# EAGLE design smd_9 (EAGLE 9.3.0)
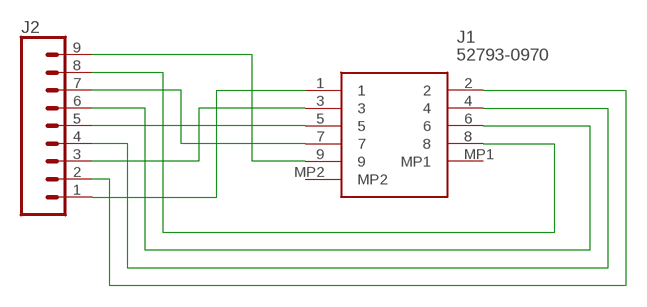
[diagram p0: schematic, sheet 1]

## Parts
J1  52793-0970  [527930970]
J2  CONN_09  [1X09]

## Nets
N$1: J1.1 J2.1
N$2: J1.2 J2.2
N$3: J1.3 J2.3
N$4: J1.4 J2.4
N$5: J1.5 J2.5
N$6: J1.6 J2.6
N$7: J1.7 J2.7
N$8: J1.8 J2.8
N$9: J1.9 J2.9
Unconnected: J1.MP1 J1.MP2

## Library data of the parts
J1 = 52793-0970:52793-0970: FFC & FPC Connectors 1.0 FFC Non ZIF HsgA ssySMT 9CktEmbsTpPkg Source: Datasheet <http://www.mouser.com/datasheet/2/276/0527930970_FFC_FPC_CONNECTORS-170567.pdf>; ALLIED_NUMBER: 71463739; ALLIED_PRICE-STOCK: https://www.alliedelec.com/molexincorporated-52793-0970/71463739/; DESCRIPTION: FFC & FPC Connectors 1.0 FFC Non ZIF HsgA ssySMT 9CktEmbsTpPkg; HEIGHT: 3.3mm; MANUFACTURER_NAME: Molex; MANUFACTURER_PART_NUMBER: 52793-0970; MOUSER_PART_NUMBER: 538-52793-0970; MOUSER_PRICE-STOCK: https://www.mouser.com/Search/Refine.aspx?Keyword=538-52793-0970
J2 = SparkFun-Connectors:CONN_09: Multi connection point. Often used as Generic Header-pin footprint for 0.1 inch spaced/style header connections On any of the 0.1 inch spaced packages, you can populate with these: Break Away Headers - Straight <https://www.sparkfun.com/products/116> (PRT-00116) Break Away Male Headers - Right Angle <https://www.sparkfun.com/products/553> (PRT-00553) Female Headers <https://www.sparkfun.com/products/115> (PRT-00115) Break Away Headers - Machine Pin <https://www.sparkfun.com/products/117> (PRT-00117) Break Away Female Headers - Swiss Machine Pin <https://www.sparkfun.com/products/743> (PRT-00743) For SCREWTERMINALS and SPRING TERMINALS visit here: Screw Terimnals on SparkFun.com <https://www.sparkfun.com/search/results?term=Screw+Terminals> (5mm/3.5mm/2.54mm spacing) This device is also useful as a general connection point to wire up your design to another part of your project. Our various solder wires solder well into these plated through hole pads. Hook-Up Wire - Assortment (Stranded, 22 AWG) <https://www.sparkfun.com/products/11375> (PRT-11375) Hook-Up Wire - Assortment (Solid Core, 22 AWG) <https://www.sparkfun.com/products/11367> (PRT-11367) View the entire wire category on our website here <https://www.sparkfun.com/categories/141> Special notes: Molex polarized connector foot print use with SKU : PRT-08231 with associated crimp pins and housings. 1MM SMD Version SKU: PRT-10208 NOTES ON THE VARIANTS LOCK and LOCK_LONGPADS... This footprint was designed to help hold the alignment of a through-hole component (i.e. 6-pin header) while soldering it into place. You may notice that each hole has been shifted either up or down by 0.005 of an inch from it's more standard position (which is a perfectly straight line). This slight alteration caused the pins (the squares in the middle) to touch the edges of the holes. Because they are alternating, it causes a "brace" to hold the component in place. 0.005 has proven to be the perfect amount of "off-center" position when using our standard breakaway headers. Although looks a little odd when you look at the bare footprint, once you have a header in there, the alteration is very hard to notice. Also,if you push a header all the way into place, it is covered up entirely on the bottom side.

## Net classes
0 default: clearance 0.254 mm

## Board
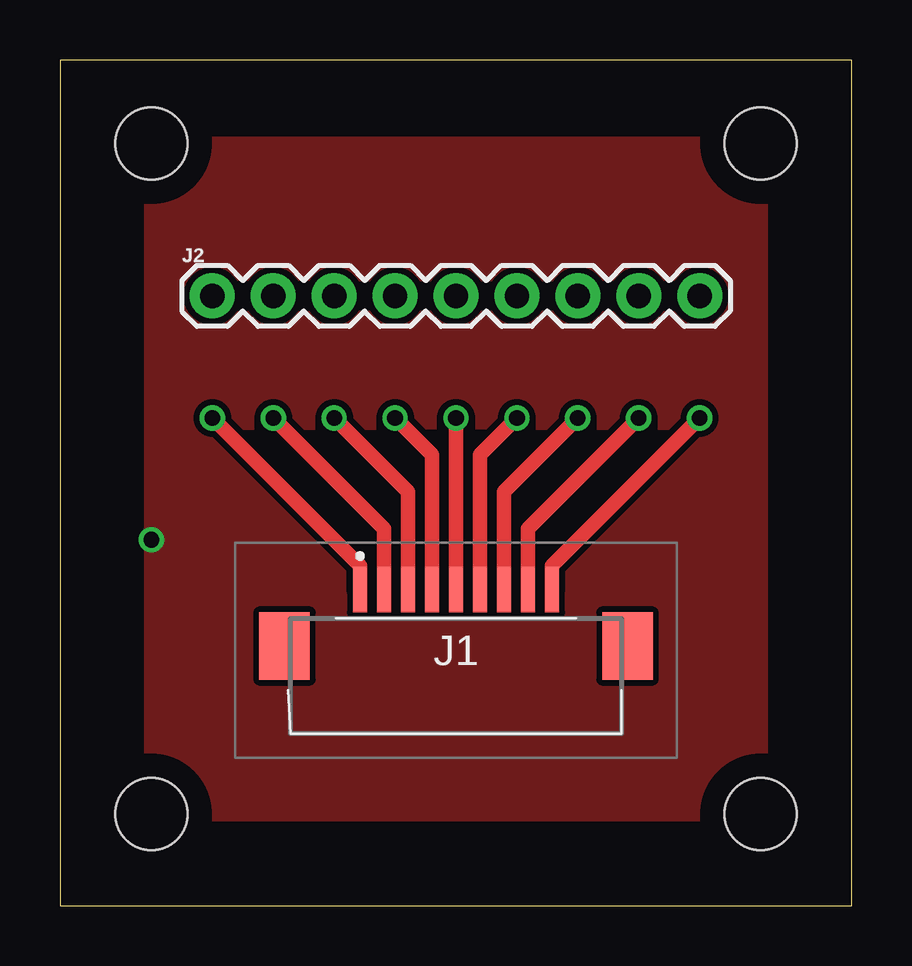
[diagram p1: board, top side]
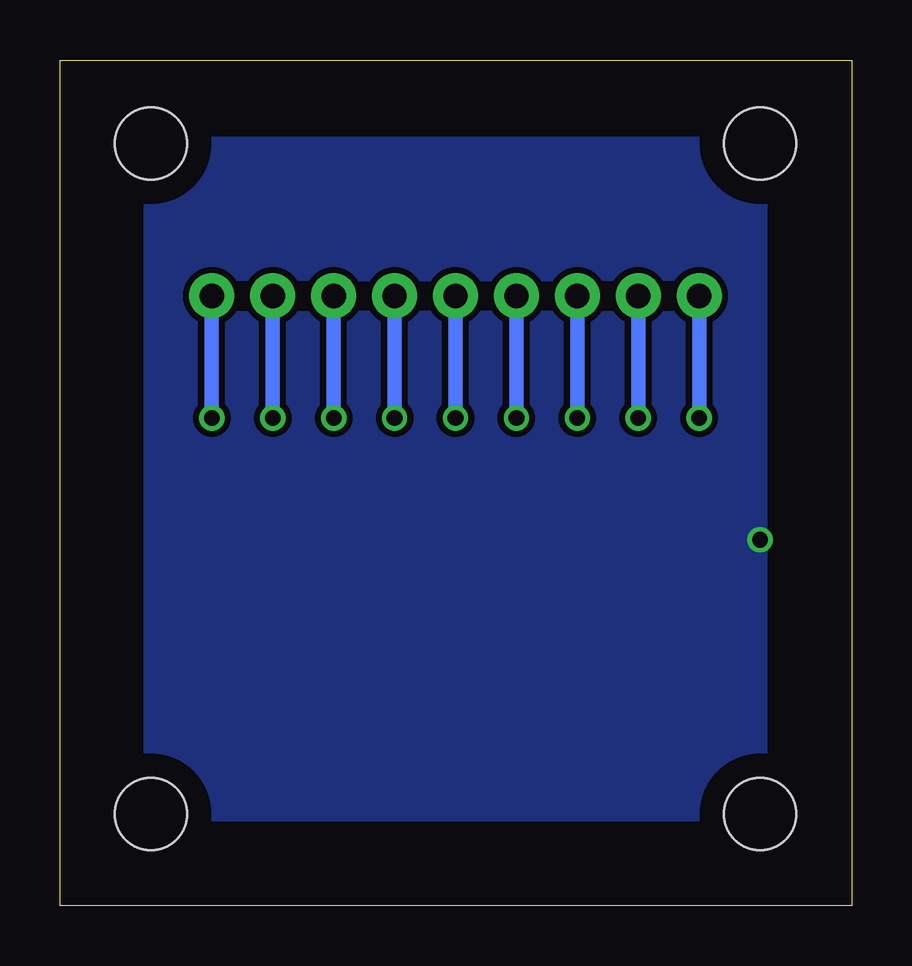
[diagram p2: board, bottom side, seen from below]

Size 33 x 35.23 mm. Coordinates in mm from the lower left corner, seen from the top.
Outline: 0,0 33,0 33,35.23 0,35.23 0,0
Copper layers (1*16): Top 0.035mm / dielectric 1.5mm / Bottom 0.035mm
Design rules "default": minimum track width 6mil, minimum drill 0.35mm, track to track 6mil, track to pad 6mil, pad to pad 6mil, via to via 6mil, smd to smd 6mil, copper to edge 40mil, drill to drill 6mil, minimum pad ring 10mil, minimum via ring 8mil, stop-mask expansion 4mil, vias tented up to drill 0mil, thermal gap 10mil
Holes 3 mm at 3.81,3.81 29.21,3.81 29.21,31.75 3.81,31.75

### Footprints (pad centres in the part's own frame; a part is rotated, then mirrored left to right if it is on the bottom)
527930970 = smd 0.6 x 1.9: 1 -4,3; 2 -3,3; 3 -2,3; 4 -1,3; 5 0,3; 6 1,3; 7 2,3; 8 3,3; 9 4,3 | smd 2.1 x 2.8: MP1 -7.15,0.65; MP2 7.15,0.65
1X09 = drill 1.016 pad 1.88: 1 0,0; 2 2.54,0; 3 5.08,0; 4 7.62,0; 5 10.16,0; 6 12.7,0; 7 15.24,0; 8 17.78,0; 9 20.32,0

### Placement (x,y rotation side)
J1  16.51,10.16 0 top
J2  6.35,25.4 0 top

### Tracks (layer width: path | path; a pad name or v marks a point on that pad's centre or on a via)
GND  (via drill 0.65)
  other vias: 3.81,15.24
  pour Bottom: 3.81,31.75 29.21,31.75 29.21,3.81 3.81,3.81
  pour Top: 3.81,31.75 29.21,31.75 29.21,3.81 3.81,3.81
N$1  (via drill 0.65)
  Top 0.61: J1.1 12.51,14.16 v6.35,20.32
  Bottom 0.61: v6.35,20.32 J2.1
N$2  (via drill 0.65)
  Top 0.61: J1.2 13.51,15.7 v8.89,20.32
  Bottom 0.61: v8.89,20.32 J2.2
N$3  (via drill 0.65)
  Top 0.61: J1.3 14.51,17.24 v11.43,20.32
  Bottom 0.61: v11.43,20.32 J2.3
N$4  (via drill 0.65)
  Top 0.61: J1.4 15.51,18.78 v13.97,20.32
  Bottom 0.61: v13.97,20.32 J2.4
N$5  (via drill 0.65)
  Top 0.61: J1.5 v16.51,20.32
  Bottom 0.61: v16.51,20.32 J2.5
N$6  (via drill 0.65)
  Top 0.61: J1.6 17.51,18.78 v19.05,20.32
  Bottom 0.61: v19.05,20.32 J2.6
N$7  (via drill 0.65)
  Top 0.61: J1.7 18.51,17.24 v21.59,20.32
  Bottom 0.61: v21.59,20.32 J2.7
N$8  (via drill 0.65)
  Top 0.61: J1.8 19.51,15.7 v24.13,20.32
  Bottom 0.61: v24.13,20.32 J2.8
N$9  (via drill 0.65)
  Top 0.61: J1.9 20.51,14.16 v26.67,20.32
  Bottom 0.61: v26.67,20.32 J2.9